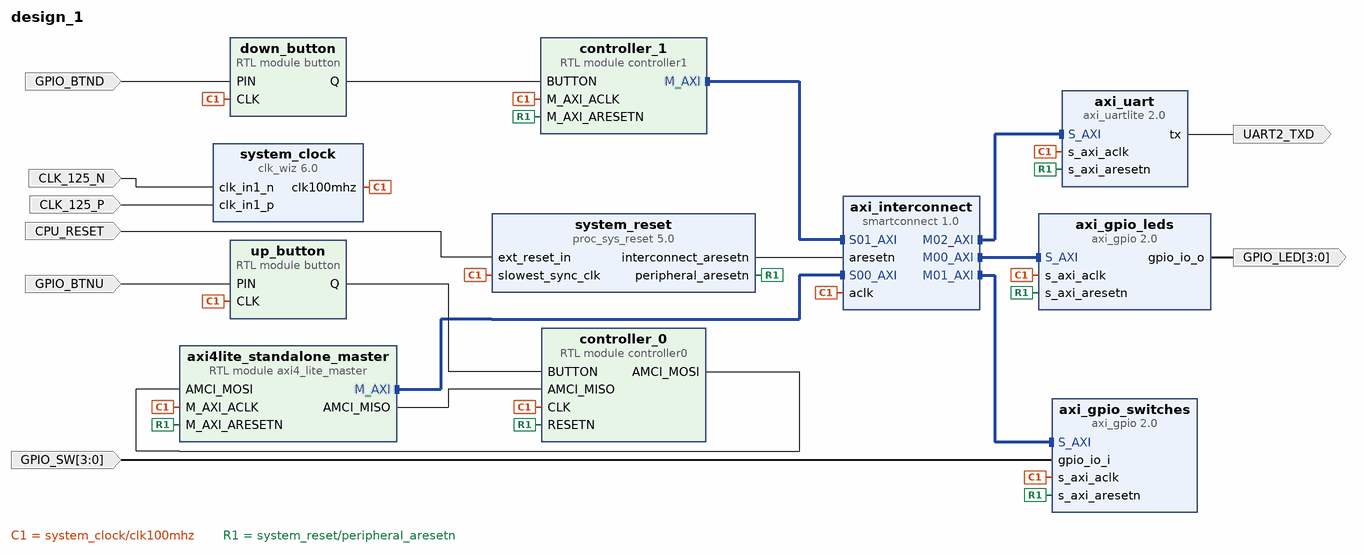
[diagram p0: block diagram of the top level]
# Vivado block design design_1, xczu7ev-ffvc1156-2-e, Vivado 2021.1
create_bd_design design_1

create_bd_port -dir I -type rst CPU_RESET
set_property -dict {CONFIG.POLARITY ACTIVE_HIGH} [get_bd_ports CPU_RESET]
create_bd_port -dir O -from 3 -to 0 GPIO_LED
create_bd_port -dir I GPIO_BTNU
create_bd_port -dir I -from 3 -to 0 GPIO_SW
create_bd_port -dir O UART2_TXD
create_bd_port -dir I GPIO_BTND
create_bd_port -dir I -type clk CLK_125_N
create_bd_port -dir I -type clk CLK_125_P
set_property -dict {CONFIG.ASSOCIATED_RESET CPU_RESET} [get_bd_ports CLK_125_P]

create_bd_cell -type module -reference axi4_lite_master axi4lite_standalone_master
create_bd_cell -type ip -vlnv xilinx.com:ip:axi_gpio:2.0 axi_gpio_leds
set_property -dict [list \
  CONFIG.C_ALL_INPUTS 0 \
  CONFIG.C_ALL_OUTPUTS 1 \
  CONFIG.C_GPIO_WIDTH 4 \
  CONFIG.GPIO_BOARD_INTERFACE Custom \
  CONFIG.USE_BOARD_FLOW true \
] [get_bd_cells axi_gpio_leds]
create_bd_cell -type ip -vlnv xilinx.com:ip:axi_gpio:2.0 axi_gpio_switches
set_property -dict [list \
  CONFIG.C_ALL_INPUTS 1 \
  CONFIG.C_GPIO_WIDTH 4 \
  CONFIG.GPIO_BOARD_INTERFACE Custom \
  CONFIG.USE_BOARD_FLOW true \
] [get_bd_cells axi_gpio_switches]
create_bd_cell -type ip -vlnv xilinx.com:ip:axi_uartlite:2.0 axi_uart
set_property -dict [list \
  CONFIG.C_BAUDRATE 115200 \
  CONFIG.UARTLITE_BOARD_INTERFACE Custom \
  CONFIG.USE_BOARD_FLOW true \
] [get_bd_cells axi_uart]
create_bd_cell -type module -reference button up_button
create_bd_cell -type module -reference button down_button
create_bd_cell -type ip -vlnv xilinx.com:ip:clk_wiz:6.0 system_clock
set_property -dict [list \
  CONFIG.CLKIN1_JITTER_PS 80.0 \
  CONFIG.CLKOUT1_DRIVES BUFGCE \
  CONFIG.CLKOUT1_JITTER 177.983 \
  CONFIG.CLKOUT1_PHASE_ERROR 222.305 \
  CONFIG.CLKOUT2_DRIVES BUFGCE \
  CONFIG.CLKOUT3_DRIVES BUFGCE \
  CONFIG.CLKOUT4_DRIVES BUFGCE \
  CONFIG.CLKOUT5_DRIVES BUFGCE \
  CONFIG.CLKOUT6_DRIVES BUFGCE \
  CONFIG.CLKOUT7_DRIVES BUFGCE \
  CONFIG.CLK_OUT1_PORT clk100mhz \
  CONFIG.FEEDBACK_SOURCE FDBK_AUTO \
  CONFIG.MMCM_CLKFBOUT_MULT_F 48.000 \
  CONFIG.MMCM_CLKIN1_PERIOD 8.000 \
  CONFIG.MMCM_CLKOUT0_DIVIDE_F 12.000 \
  CONFIG.MMCM_COMPENSATION AUTO \
  CONFIG.MMCM_DIVCLK_DIVIDE 5 \
  CONFIG.PHASESHIFT_MODE WAVEFORM \
  CONFIG.PRIM_IN_FREQ 125.000 \
  CONFIG.PRIM_SOURCE Differential_clock_capable_pin \
  CONFIG.USE_LOCKED false \
  CONFIG.USE_PHASE_ALIGNMENT true \
  CONFIG.USE_RESET false \
  CONFIG.USE_SAFE_CLOCK_STARTUP true \
] [get_bd_cells system_clock]
create_bd_cell -type module -reference controller0 controller_0
create_bd_cell -type module -reference controller1 controller_1
create_bd_cell -type ip -vlnv xilinx.com:ip:proc_sys_reset:5.0 system_reset
set_property -dict [list \
  CONFIG.C_EXT_RESET_HIGH 1 \
  CONFIG.RESET_BOARD_INTERFACE reset \
  CONFIG.USE_BOARD_FLOW true \
] [get_bd_cells system_reset]
create_bd_cell -type ip -vlnv xilinx.com:ip:smartconnect:1.0 axi_interconnect
set_property -dict {CONFIG.NUM_MI 3 CONFIG.NUM_SI 2} [get_bd_cells axi_interconnect]

# ---- connections ----

connect_bd_intf_net [get_bd_intf_pins axi_interconnect/S00_AXI] [get_bd_intf_pins axi4lite_standalone_master/M_AXI]
connect_bd_intf_net [get_bd_intf_pins axi_interconnect/M02_AXI] [get_bd_intf_pins axi_uart/S_AXI]
connect_bd_intf_net -intf_net controller1_0_M_AXI [get_bd_intf_pins controller_1/M_AXI] [get_bd_intf_pins axi_interconnect/S01_AXI]
connect_bd_intf_net -intf_net smartconnect_0_M00_AXI [get_bd_intf_pins axi_interconnect/M00_AXI] [get_bd_intf_pins axi_gpio_leds/S_AXI]
connect_bd_intf_net -intf_net smartconnect_0_M01_AXI [get_bd_intf_pins axi_interconnect/M01_AXI] [get_bd_intf_pins axi_gpio_switches/S_AXI]
connect_bd_net -net PIN_0_1 [get_bd_ports GPIO_BTNU] [get_bd_pins up_button/PIN]
connect_bd_net -net PIN_0_2 [get_bd_ports GPIO_BTND] [get_bd_pins down_button/PIN]
connect_bd_net -net axi4_lite_master_0_AMCI_MISO [get_bd_pins axi4lite_standalone_master/AMCI_MISO] [get_bd_pins controller_0/AMCI_MISO]
connect_bd_net -net axi_gpio_0_gpio_io_o [get_bd_pins axi_gpio_leds/gpio_io_o] [get_bd_ports GPIO_LED]
connect_bd_net -net axi_uartlite_0_tx [get_bd_pins axi_uart/tx] [get_bd_ports UART2_TXD]
connect_bd_net -net button_0_Q [get_bd_pins up_button/Q] [get_bd_pins controller_0/BUTTON]
connect_bd_net -net button_0_Q1 [get_bd_pins down_button/Q] [get_bd_pins controller_1/BUTTON]
connect_bd_net -net clk_in1_n_0_1 [get_bd_ports CLK_125_N] [get_bd_pins system_clock/clk_in1_n]
connect_bd_net -net clk_in1_p_0_1 [get_bd_ports CLK_125_P] [get_bd_pins system_clock/clk_in1_p]
connect_bd_net [get_bd_pins controller_0/AMCI_MOSI] [get_bd_pins axi4lite_standalone_master/AMCI_MOSI]
connect_bd_net -net ext_reset_in_0_1 [get_bd_ports CPU_RESET] [get_bd_pins system_reset/ext_reset_in]
connect_bd_net -net gpio_io_i_0_1 [get_bd_ports GPIO_SW] [get_bd_pins axi_gpio_switches/gpio_io_i]
connect_bd_net [get_bd_pins system_clock/clk100mhz] \
  [get_bd_pins axi4lite_standalone_master/M_AXI_ACLK] [get_bd_pins axi_gpio_leds/s_axi_aclk] \
  [get_bd_pins axi_gpio_switches/s_axi_aclk] [get_bd_pins axi_uart/s_axi_aclk] [get_bd_pins up_button/CLK] \
  [get_bd_pins down_button/CLK] [get_bd_pins controller_0/CLK] [get_bd_pins controller_1/M_AXI_ACLK] \
  [get_bd_pins system_reset/slowest_sync_clk] [get_bd_pins axi_interconnect/aclk]
connect_bd_net [get_bd_pins system_reset/interconnect_aresetn] [get_bd_pins axi_interconnect/aresetn]
connect_bd_net [get_bd_pins system_reset/peripheral_aresetn] \
  [get_bd_pins axi4lite_standalone_master/M_AXI_ARESETN] [get_bd_pins axi_gpio_leds/s_axi_aresetn] \
  [get_bd_pins axi_gpio_switches/s_axi_aresetn] [get_bd_pins axi_uart/s_axi_aresetn] [get_bd_pins controller_0/RESETN] \
  [get_bd_pins controller_1/M_AXI_ARESETN]

# ---- address map ----
assign_bd_address -offset 0x40000000 -range 64K -target_address_space [get_bd_addr_spaces axi4lite_standalone_master/M_AXI] [get_bd_addr_segs axi_gpio_leds/S_AXI/Reg]
assign_bd_address -offset 0x40010000 -range 64K -target_address_space [get_bd_addr_spaces axi4lite_standalone_master/M_AXI] [get_bd_addr_segs axi_gpio_switches/S_AXI/Reg]
assign_bd_address -offset 0x40600000 -range 64K -target_address_space [get_bd_addr_spaces axi4lite_standalone_master/M_AXI] [get_bd_addr_segs axi_uart/S_AXI/Reg]
assign_bd_address -offset 0x40000000 -range 64K -target_address_space [get_bd_addr_spaces controller_1/M_AXI] [get_bd_addr_segs axi_gpio_leds/S_AXI/Reg]
assign_bd_address -offset 0x40010000 -range 64K -target_address_space [get_bd_addr_spaces controller_1/M_AXI] [get_bd_addr_segs axi_gpio_switches/S_AXI/Reg]
assign_bd_address -offset 0x40600000 -range 64K -target_address_space [get_bd_addr_spaces controller_1/M_AXI] [get_bd_addr_segs axi_uart/S_AXI/Reg]

validate_bd_design
save_bd_design
